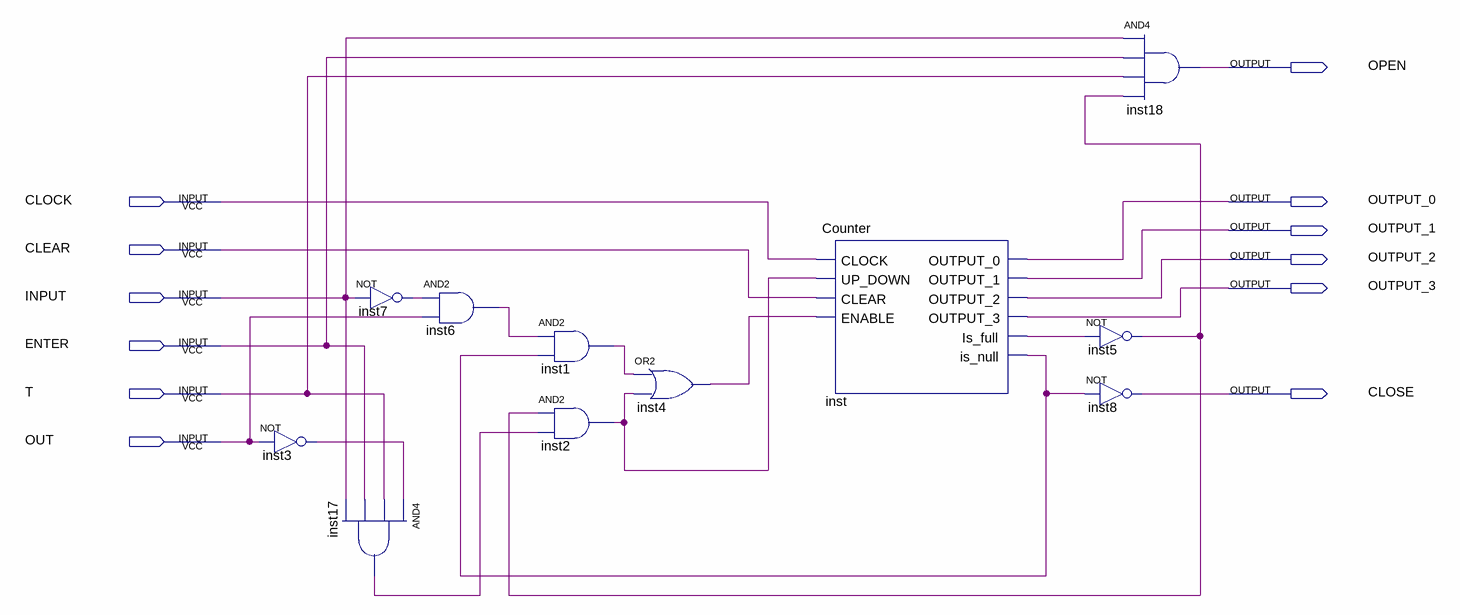
[diagram p0: schematic sheet]
// Quartus schematic Main_room.bdf as structural Verilog: 11 symbols, 12 pins
module Main_room (
  input  CLOCK,
  input  CLEAR,
  input  INPUT,
  input  ENTER,
  input  T,
  input  OUT,
  output OPEN,
  output OUTPUT_0,
  output OUTPUT_1,
  output OUTPUT_2,
  output OUTPUT_3,
  output CLOSE
);

  wire inst1_out, inst2_out, inst3_out, inst4_out, inst5_out, inst6_out, inst7_out, inst17_out, inst_is_full,
       inst_is_null;

  not inst3 (inst3_out, OUT);
  not inst7 (inst7_out, INPUT);
  and inst17 (inst17_out, inst3_out, T, ENTER, INPUT);
  and inst6 (inst6_out, inst7_out, OUT);
  and inst1 (inst1_out, inst6_out, inst_is_null);
  and inst2 (inst2_out, inst5_out, inst17_out);
  or inst4 (inst4_out, inst1_out, inst2_out);
  Counter inst (
    .CLOCK(CLOCK), .UP_DOWN(inst2_out), .CLEAR(CLEAR), .ENABLE(inst4_out), .OUTPUT_0(OUTPUT_0),
    .OUTPUT_1(OUTPUT_1), .OUTPUT_2(OUTPUT_2), .OUTPUT_3(OUTPUT_3), .Is_full(inst_is_full),
    .is_null(inst_is_null));
  and inst18 (OPEN, INPUT, ENTER, T, inst5_out);
  not inst5 (inst5_out, inst_is_full);
  not inst8 (CLOSE, inst_is_null);
endmodule
